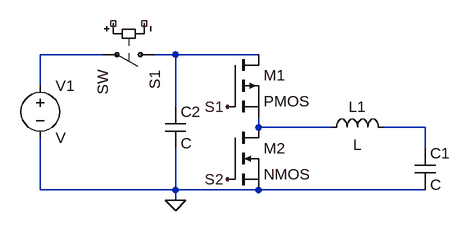
[diagram p0: schematic Draft4.asc]
Draft4.asc, the LTspice schematic file:
Version 4
SHEET 1 880 680
WIRE -128 48 -224 48
WIRE -16 48 -48 48
WIRE 112 48 -16 48
WIRE -224 96 -224 48
WIRE -16 128 -16 48
WIRE 112 160 112 144
WIRE 224 160 112 160
WIRE 368 160 304 160
WIRE 368 192 368 160
WIRE -224 256 -224 176
WIRE -16 256 -16 192
WIRE -16 256 -224 256
WIRE 112 256 -16 256
WIRE 368 256 112 256
WIRE -16 272 -16 256
FLAG -16 272 0
FLAG 64 128 S1
FLAG 64 240 S2
SYMBOL ind 208 176 R270
WINDOW 0 32 56 VTop 2
WINDOW 3 5 56 VBottom 2
SYMATTR InstName L1
SYMBOL cap 352 192 R0
SYMATTR InstName C1
SYMBOL pmos 64 48 R0
SYMATTR InstName M1
SYMBOL nmos 64 160 R0
SYMATTR InstName M2
SYMBOL cap -32 128 R0
SYMATTR InstName C2
SYMBOL sw -32 48 R90
SYMATTR InstName S1
SYMBOL voltage -224 80 R0
SYMATTR InstName V1

The netlist it stands for:
* Draft4.asc
L1 N003 N004 L
C1 N004 0 C
M1 N002 S1 N003 N003 PMOS
M2 N003 S2 0 0 NMOS
C2 N002 0 C
S1 N002 N001 NC_01 NC_02 SW
V1 N001 0 V
.model NMOS NMOS
.model PMOS PMOS
.lib standard.mos
.backanno
.end